# Altium schematic sheet CPU.SchDoc
size A4; DocumentNumber: 2; SheetNumber: 2; SheetTotal: 4
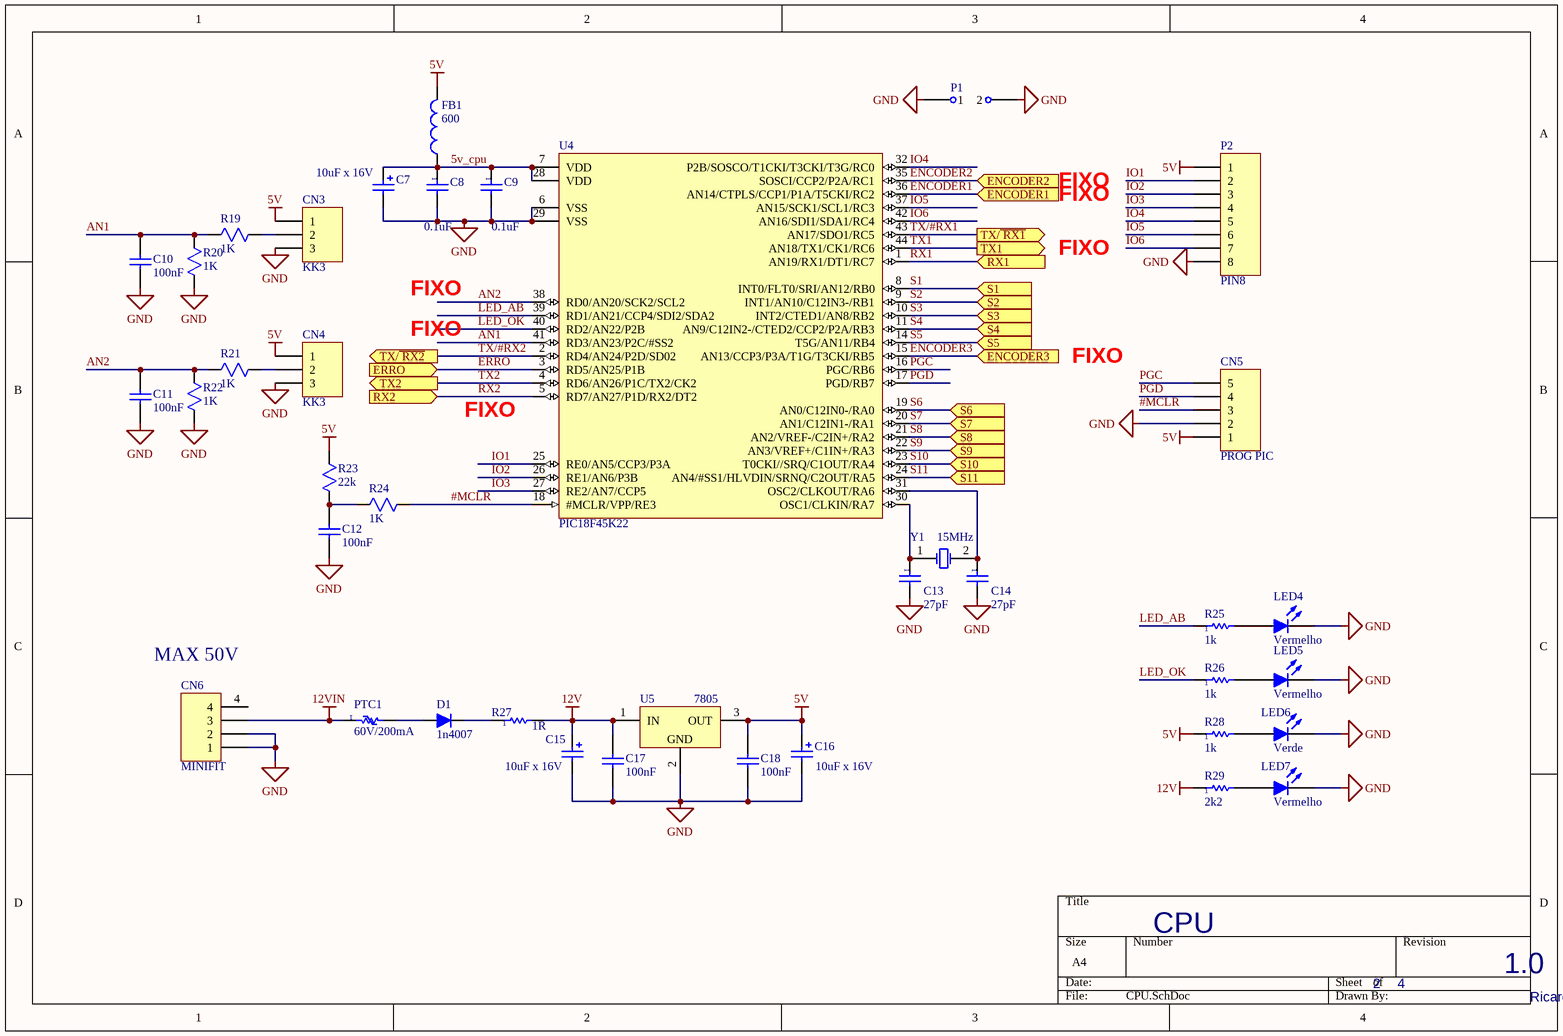
[diagram p0: CPU.SchDoc]

## Parts
C7  10uF x 16V  [CapTant_SMD_A]
C8  0.1uF  [SMD_0805]
C9  0.1uF  [SMD_0805]
C10  100nF  [SMD0805C]
C11  100nF  [SMD0805C]
C12  100nF  [SMD0805C]
C13  27pF  [SMD_0805]
C14  27pF  [SMD_0805]
C15  10uF x 16V  [CapPol_SMD_C]
C16  10uF x 16V  [CapPol_SMD_C]
C17  100nF  [SMD0805C]
C18  100nF  [SMD0805C]
CN3  KK3  [KK3 - 2.54mm]
CN4  KK3  [KK3 - 2.54mm]
CN5  PROG PIC  [PROG PIC]
CN6  MINIFIT  [MFJRH4X1]
D1  1n4007  [DIODE-400]
FB1  600  [SMD_0805]
LED4  Vermelho  [LED_SMD_0805]
LED5  Vermelho  [LED_SMD_0805]
LED6  Verde  [LED_SMD_0805]
LED7  Vermelho  [LED_SMD_0805]
P1  JMP_2  [JMP_DIP2]  (value not drawn)
P2  PIN8  [PIN8]
PTC1  60V/200mA  [PTC-200]
R19  1K  [SMD0805]
R20  1K  [SMD0805]
R21  1K  [SMD0805]
R22  1K  [SMD0805]
R23  22k  [SMD0805]
R24  1K  [SMD0805]
R25  1k  [SMD_0805]
R26  1k  [SMD_0805]
R27  1R  [AXIAL-500]
R28  1k  [SMD_0805]
R29  2k2  [SMD_0805]
U4  PIC18F45K22  [QFP10X10-G44/Y1.8N]
U5  7805  [TO220_V]
Y1  15MHz  [CRYSTAL]

## Ports
ENCODER1 (in), ENCODER2 (in), ENCODER3 (in), ERRO (in), RX1 (in), RX2 (in), S1 (in), S2 (in), S3 (in), S4 (in), S5 (in), S6 (in), S7 (in), S8 (in), S9 (in), S10 (in), S11 (in), TX1 (out), TX2 (out), TX/~{ RX1} (out), TX/~{ RX2} (out)

## Nets
5V: C16.1 C18.1 CN3.1 CN4.1 CN5.1 FB1.2 P2.1 R23.1 R28.1 U5.3(OUT)
12V: C15.1 C17.1 R27.2 R29.1 U5.1(IN)
12VIN: CN6.3 PTC1.1
GND: C7.2 C8.2 C9.2 C10.2 C11.2 C12.2 C13.2 C14.2 C15.2 C16.2 C17.2 C18.2 CN3.3 CN4.3 CN5.2 CN6.1 CN6.2 LED4.2(K) LED5.2(K) LED6.2(K) LED7.2(K) P1.1 P1.2 P2.8 R20.1 R22.1 U4.6(VSS) U4.29(VSS) U5.2(GND)
5v_cpu: C7.1 C8.1 C9.1 FB1.1 U4.7(VDD) U4.28(VDD)
#MCLR: CN5.3 R24.2 U4.18(#MCLR/VPP/RE3)
AN1: C10.1 R19.1 R20.2 U4.41(RD3/AN23/P2C/#SS2)
AN2: C11.1 R21.1 R22.2 U4.38(RD0/AN20/SCK2/SCL2)
ENCODER1: U4.36(AN14/CTPLS/CCP1/P1A/T5CKI/RC2) ; port ENCODER1
ENCODER2: U4.35(SOSCI/CCP2/P2A/RC1) ; port ENCODER2
ENCODER3: U4.15(AN13/CCP3/P3A/T1G/T3CKI/RB5) ; port ENCODER3
ERRO: U4.3(RD5/AN25/P1B) ; port ERRO
IO1: P2.2 U4.25(RE0/AN5/CCP3/P3A)
IO2: P2.3 U4.26(RE1/AN6/P3B)
IO3: P2.4 U4.27(RE2/AN7/CCP5)
IO4: P2.5 U4.32(P2B/SOSCO/T1CKI/T3CKI/T3G/RC0)
IO5: P2.6 U4.37(AN15/SCK1/SCL1/RC3)
IO6: P2.7 U4.42(AN16/SDI1/SDA1/RC4)
LED_AB: R25.1 U4.39(RD1/AN21/CCP4/SDI2/SDA2)
LED_OK: R26.1 U4.40(RD2/AN22/P2B)
PGC: CN5.5 U4.16(PGC/RB6)
PGD: CN5.4 U4.17(PGD/RB7)
RX1: U4.1(AN19/RX1/DT1/RC7) ; port RX1
RX2: U4.5(RD7/AN27/P1D/RX2/DT2) ; port RX2
S1: U4.8(INT0/FLT0/SRI/AN12/RB0) ; port S1
S2: U4.9(INT1/AN10/C12IN3-/RB1) ; port S2
S3: U4.10(INT2/CTED1/AN8/RB2) ; port S3
S4: U4.11(AN9/C12IN2-/CTED2/CCP2/P2A/RB3) ; port S4
S5: U4.14(T5G/AN11/RB4) ; port S5
S6: U4.19(AN0/C12IN0-/RA0) ; port S6
S7: U4.20(AN1/C12IN1-/RA1) ; port S7
S8: U4.21(AN2/VREF-/C2IN+/RA2) ; port S8
S9: U4.22(AN3/VREF+/C1IN+/RA3) ; port S9
S10: U4.23(T0CKI//SRQ/C1OUT/RA4) ; port S10
S11: U4.24(AN4/#SS1/HLVDIN/SRNQ/C2OUT/RA5) ; port S11
TX1: U4.44(AN18/TX1/CK1/RC6) ; port TX1
TX2: U4.4(RD6/AN26/P1C/TX2/CK2) ; port TX2
TX/#RX1: U4.43(AN17/SDO1/RC5) ; port TX/~{ RX1}
TX/#RX2: U4.2(RD4/AN24/P2D/SD02) ; port TX/~{ RX2}
NetC12_1: C12.1 R23.2 R24.1
NetC13_1: C13.1 U4.30(OSC1/CLKIN/RA7) Y1.1(OSC1)
NetC14_1: C14.1 U4.31(OSC2/CLKOUT/RA6) Y1.2(OSC2)
NetCN3_2: CN3.2 R19.2
NetCN4_2: CN4.2 R21.2
NetD1_1: D1.1(K) R27.1
NetD1_2: D1.2(A) PTC1.2
NetLED4_1: LED4.1(A) R25.2
NetLED5_1: LED5.1(A) R26.2
NetLED6_1: LED6.1(A) R28.2
NetLED7_1: LED7.1(A) R29.2

Not connected (* = marked no-connect by the designer): CN6 4

## Notes on the sheet
- FIXO
- (near U4) FIXO
- (near CN6) MAX 50V
- CPU
- 2
- 4
- 1.0
- Ricardo Cardoso Felipe

## Library data of the parts
C7 C15 C16 = CapPol: Polarized Capacitor; Class I: Passive; Revision: July-2002: Re-released for DXP Platform.; Class II: Capacitor; Value: *
C8 C9 C13 C14 = Cap: Capacitor; Manufacturer: Generic Components; Class I: Passive; Revision: July-2002: Re-released for DXP Platform.; Class II: Capacitor; Value: *
C10-C12 C17 C18 = CAP: Capacitor
CN3 CN4 = KK3: Conector Linear tipo KK de 3 vias
CN5 = PROG PIC: Conector para gravação do PIC
CN6 = MINIFIT4: Conector minifit de 4 vias
D1 = Diodo: Diodos de diversos tamanhos; Manufacturer: Generic Components; Class I: Discrete; Class II: Diode - Switching; Published: 8-Jun-2000; Revision: July-2002: Re-released for DXP Platform.; Publisher: Altium Limited
FB1 = FerriteBead: Ferrite Bead Inductor; Class I: Passive; Revision: July-2002: Re-released for DXP Platform.; Class II: Inductor; Value: *
LED4-LED7 = Led: Manufacturer: Generic Components; Class I: Optoelectronic; Published: 8-Jun-2000; Revision: July-2002: Re-released for DXP Platform.; Publisher: Altium Limited; Class II: LED
P1 = JMP_2: Jumper 2 terminais; Manufacturer: Generic Components; Published: 24-Mar-1999; Revision: July-2002: Re-released for DXP Platform.; Publisher: Altium Limited
P2 = PIN8: Conector Linear
PTC1 = PTC: Termistor; Class I: Passive; Class II: Resistor; Revision: July-2002: Re-released for DXP Platform.; Value: *
R19-R24 = Resistor
R25-R29 = Res: Resistor; Class I: Passive; Revision: July-2002: Re-released for DXP Platform.; Class II: Resistor; Value: *
U4 = PIC18F45K22_SMD: Microcontrollers with nanoWatt XLP Technology; FirstPublished: 29-Jan-2009; LatestRevisionDate: 02-Dec-2009; LatestRevisionNote: Updated to datasheet revision F, Sep-2009; DatasheetVersion: revF, Sep-2009; PackageVersion: revBB, Aug-2009; PackageReference: PDIP600-P40; Publisher: Altium Limited; PackageDescription: 40-Lead Plastic Dual In-Line (P) - 600 mil Body [PDIP]; Supplier 1: Digi-Key; Supplier Part Number 1: PIC18F45K20-I/P-ND; Supplier 2: Farnell; Supplier Part Number 2: 1439588; Supplier 3: Newark; Supplier Part Number 3: 88K6041; ComponentLink1Description: Datasheet; ComponentLink1URL: http://ww1.microchip.com/downloads/en/DeviceDoc/41303F.pdf; ComponentLink2Description: Packaging Specification; ComponentLink2URL: http://www.microchip.com/stellent/groups/techpub_sg/documents/packagingspec/en012702.pdf; ComponentLink3Description: Microchip.com Home; ComponentLink3URL: http://www.microchip.com/
U5 = 78xx: Series 3-Terminal Positive Regulator; Manufacturer: National Semiconductor; Package Information: Latest Revision: 1995; Class I: Power Management; Class II: Voltage Regulator; Note: Tab is connected to GND; Published: 15-Apr-2002; Datasheet: Latest Revision: May-1999; Package Reference: T03B; Publisher: Altium Limited
Y1 = Cristal: Crystal Oscillator; Revision: July-2002: Re-released for DXP Platform.; Class I: Oscillator; Class II: Crystal Oscillator